# Altium schematic sheet LED-Driver.SchDoc: LED Driver
size A; DocumentNumber: 5; SheetNumber: 5; SheetTotal: 22
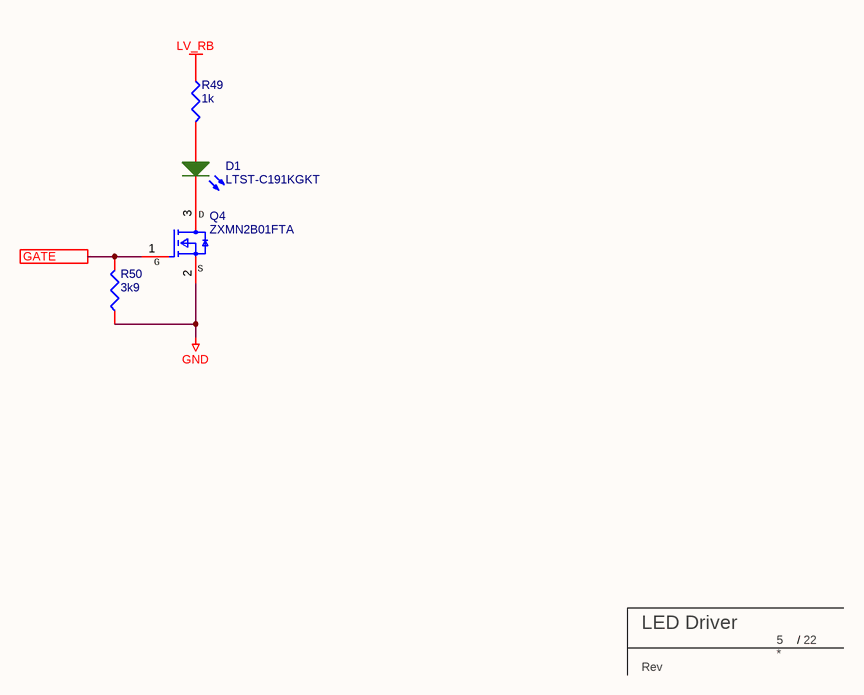
[diagram p0: LED-Driver.SchDoc]

## Parts
D1  LTST-C191KGKT  [LED_RED]
Q4  ZXMN2B01FTA  [SOT-23]
R49  1k  [R_0402_IPC]
R50  3k9  [R_0402_IPC]
TBLOCK?  BU Title block  (value not drawn)  (graphical)

## Ports
GATE

## Nets
GND: Q4.2(Source) R50.1
LV_RB: R49.1
GATE: Q4.1(Gate) R50.2 ; port GATE
NetD1_1: D1.1(A) R49.2
NetD1_2: D1.2(K) Q4.3(Drain)

## Notes on the sheet
- (in symbol TITLE_BLOCK_BU) /; Rev
- (in symbol ZXMN2B01FTA) D; G; S

## Library data of the parts
D1 = LED2: Typical RED, GREEN, YELLOW, AMBER GaAs LED; Published: 8-Jun-2000; LatestRevisionDate: 17-Jul-2002; LatestRevisionNote: Re-released for DXP Platform.; PackageVersion: Feb-2002; PackageReference: 3.2X1.6X1.1; Publisher: Altium Limited; PackageDescription: SM LED; 2 Flat Leads
Q4 = ZXMN2B01FTA: MOSFET N-CH 20V 2.1A SOT-23-3; ComponentLink2Description: Datasheet; ComponentLink2URL: https://www.diodes.com/assets/Datasheets/ZXMN2B01F.pdf
R49 = R-E3-1K0-0402-0.5%: RES SMD 1K OHM 0.5% 1/16W 0402; Part Number: RR0510P-102-D
R50 = R-E3-3K9-0402-5%: RES SMD 3.9K OHM 5% 1/16W 0402
TBLOCK? = TITLE_BLOCK_BU